# Altium schematic sheet G118_9563_Demo.SchDoc
size A3; PageSetup: Record=PageOptions|CenterHorizontal=True|CenterVertical=True|PrintScale=0.71|XCorrection=1.00|YCorrection=1.00|PrintKind=1|BorderSize=5000000|LeftOffset=0|BottomOffset=0|Orientation=2|PaperLength=2970|PaperWidth=2100|Scale=100|PaperSource=7|PrintQuality=-3|MediaType=1|DitherType=10|PrintScaleMode=1|PaperKind=A4 (210 x 297 毫米)|PaperIndex=9
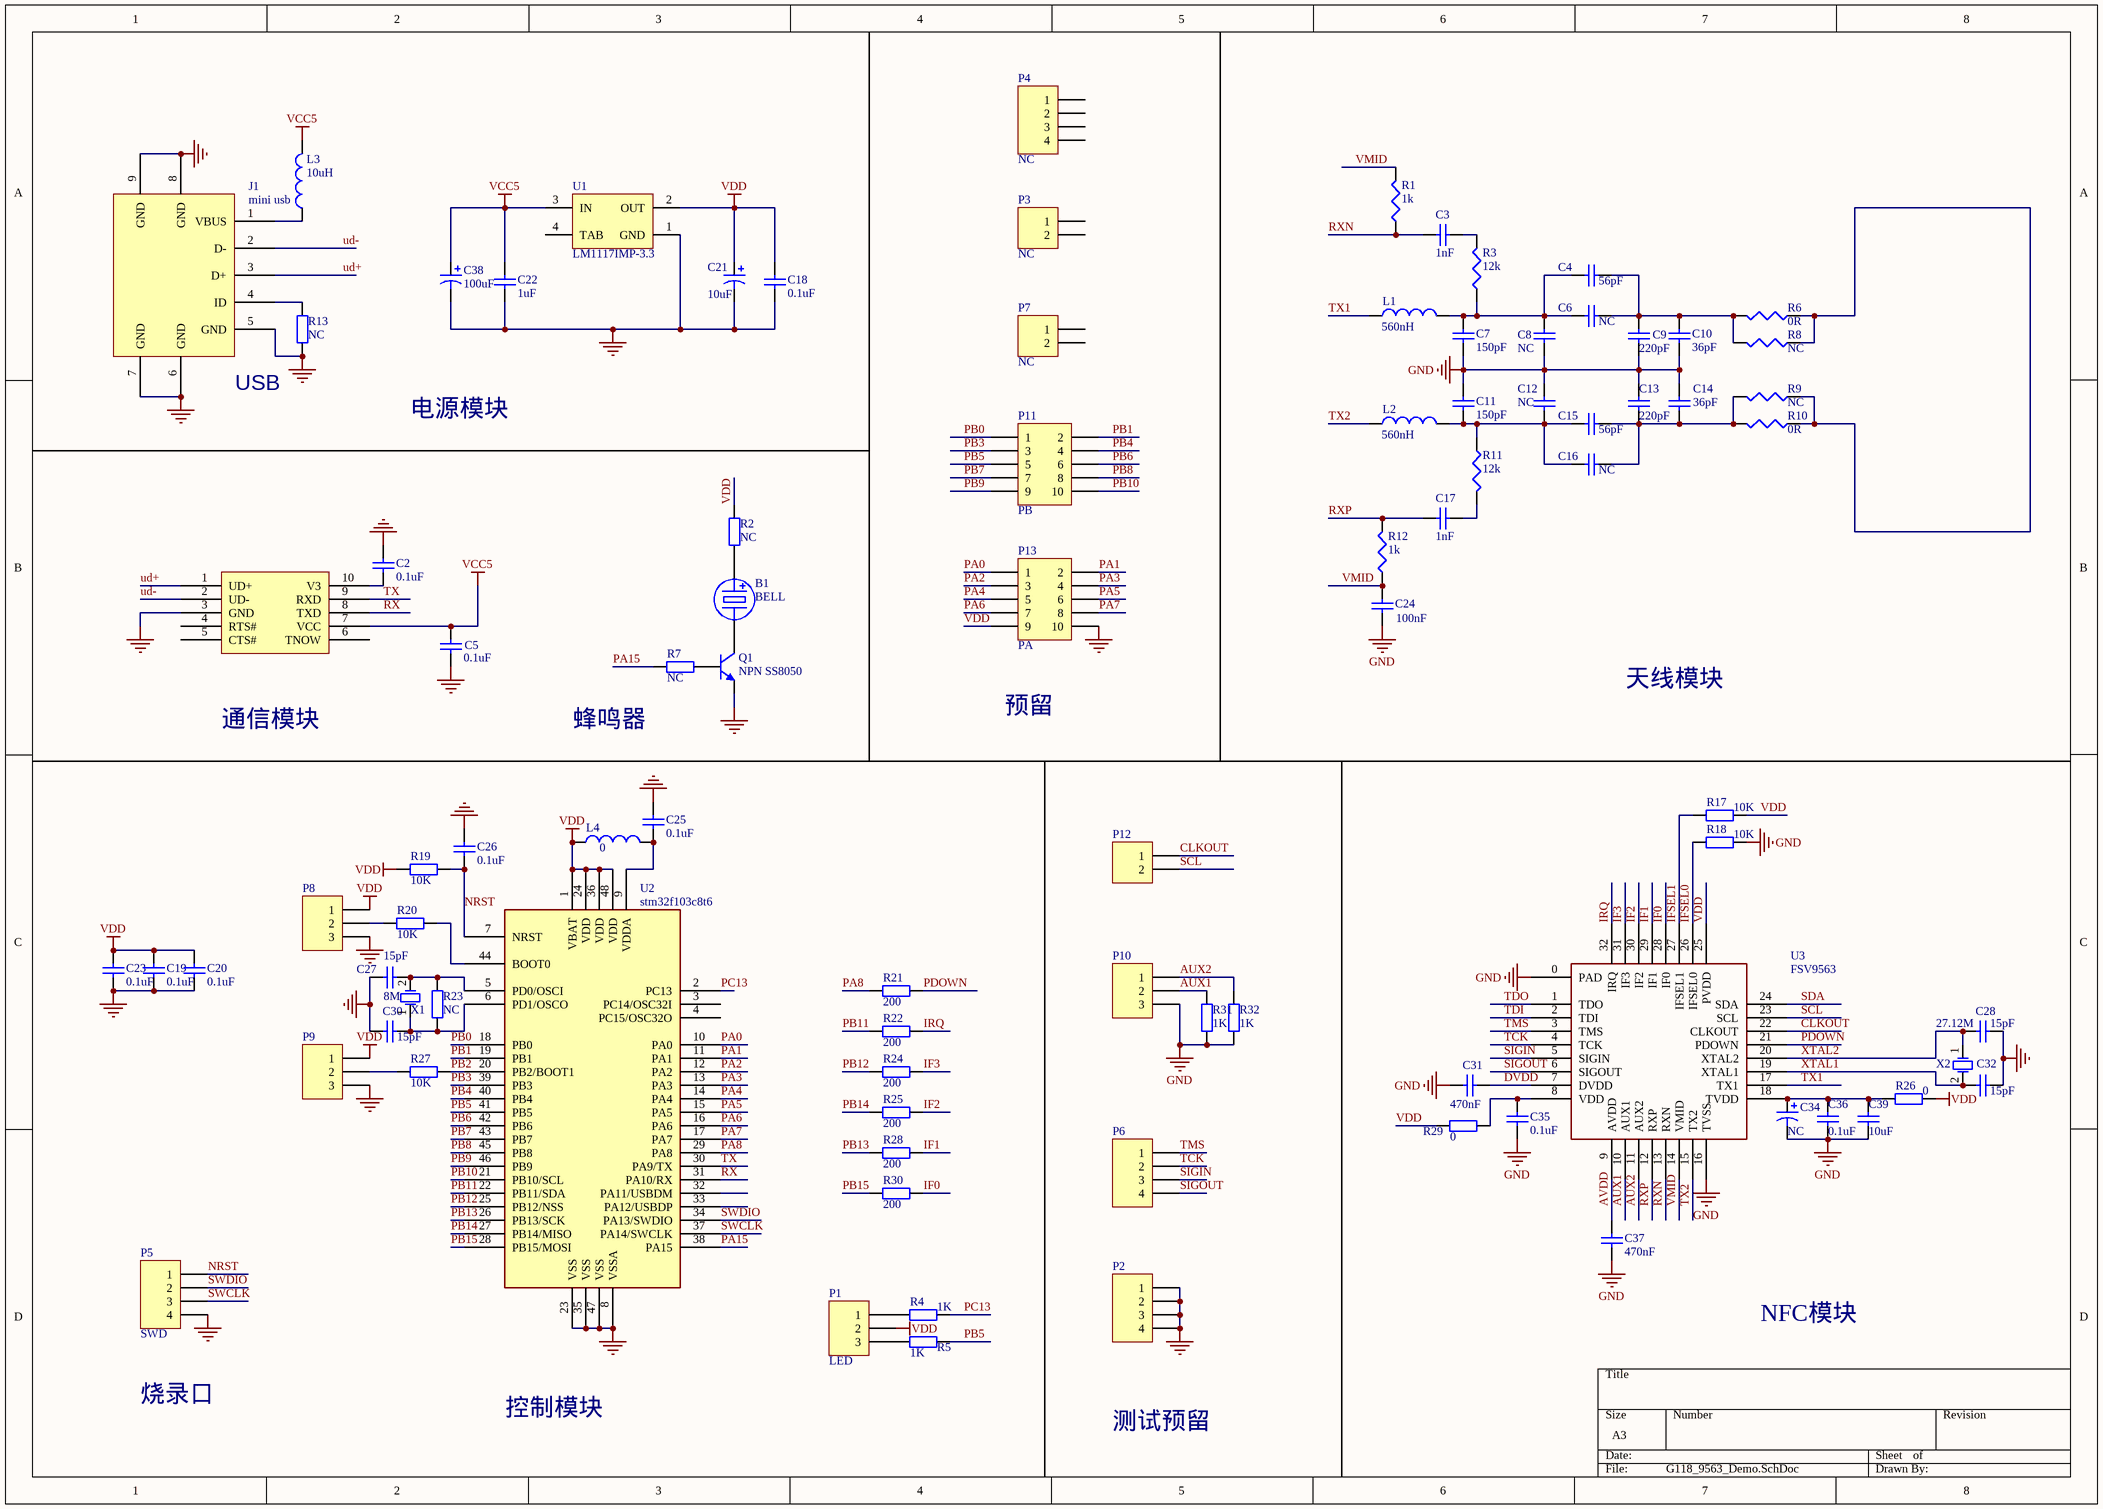
[diagram p0: G118_9563_Demo.SchDoc]

## Parts
B1  BELL  [BELL_S]
C2  0.1uF  [0704C]
C3  value 1nF  [0704C]  (hidden comment: Cap Semi)
C4  value 56pF  [0704C]  (hidden comment: Cap Semi)
C5  0.1uF  [0704C]
C6  value NC  [0704C]  (hidden comment: Cap Semi)
C7  value 150pF  [0704C]  (hidden comment: Cap Semi)
C8  value NC  [0704C]  (hidden comment: Cap Semi)
C9  value 220pF  [0704C]  (hidden comment: Cap Semi)
C10  value 36pF  [0704C]  (hidden comment: Cap Semi)
C11  value 150pF  [0704C]  (hidden comment: Cap Semi)
C12  value NC  [0704C]  (hidden comment: Cap Semi)
C13  value 220pF  [0704C]  (hidden comment: Cap Semi)
C14  value 36pF  [0704C]  (hidden comment: Cap Semi)
C15  value 56pF  [0704C]  (hidden comment: Cap Semi)
C16  value NC  [0704C]  (hidden comment: Cap Semi)
C17  value 1nF  [0704C]  (hidden comment: Cap Semi)
C18  0.1uF  [0704C]
C19  0.1uF  [0704C]
C20  0.1uF  [0704C]
C21  10uF  [RB.1/.2]
C22  1uF  [0704C]
C23  0.1uF  [0704C]
C24  value 100nF  [0704C]
C25  0.1uF  [0704C]
C26  0.1uF  [0704C]
C27  15pF  [0704C]
C28  15pF  [0704C]
C30  15pF  [0704C]
C31  value 470nF  [0704C]  (hidden comment: Cap Semi)
C32  15pF  [0704C]
C34  NC  [RB.1/.2]
C35  0.1uF  [0704C]
C36  0.1uF  [0704C]
C37  value 470nF  [0704C]  (hidden comment: Cap Semi)
C38  100uF  [RB.1/.2]
C39  10uF  [0704C]
CH1  CH340E  [msop-10]  (value not drawn)
J1  mini usb  [usb_mini]
L1  value 560nH  [1210L]  (hidden comment: Inductor)
L2  value 560nH  [1210L]  (hidden comment: Inductor)
L3  10uH  [1206]
L4  0  [1206]
P1  LED  [HDR1X3]
P2  (no value)  [HDR1X4]
P3  NC  [HDR1X2]
P4  NC  [HDR1X4]
P5  SWD  [HDR1X4]
P6  (no value)  [HDR1X4]
P7  NC  [HDR1X2]
P8  (no value)  [HDR1X3]
P9  (no value)  [HDR1X3]
P10  (no value)  [HDR1X3]
P11  PB  [HDR2X5]
P12  (no value)  [HDR1X2]
P13  PA  [HDR2X5]
Q1  NPN SS8050  [SOT-23-2]
R1  value 1k  [0704]  (hidden comment: Res3)
R2  NC  [0704]
R3  value 12k  [0704]  (hidden comment: Res3)
R4  1K  [0704]
R5  1K  [0704]
R6  value 0R  [0704]  (hidden comment: Res3)
R7  NC  [0704]
R8  value NC  [0704]  (hidden comment: Res3)
R9  value NC  [0704]  (hidden comment: Res3)
R10  value 0R  [0704]  (hidden comment: Res3)
R11  value 12k  [0704]  (hidden comment: Res3)
R12  value 1k  [0704]  (hidden comment: Res3)
R13  NC  [0704]
R17  10K  [0704]
R18  10K  [0704]
R19  10K  [0704]
R20  10K  [0704]
R21  200  [0704]
R22  200  [0704]
R23  NC  [0704]
R24  200  [0704]
R25  200  [0704]
R26  0  [0704]
R27  10K  [0704]
R28  200  [0704]
R29  0  [0704]
R30  200  [0704]
R31  1K  [0704]
R32  1K  [0704]
U1  LM1117IMP-3.3  [MP04A_N]
U2  stm32f103c8t6  [LQFP48L]
U3  FSV9563  [QFN-32]
X1  8M  [CRYSTAL]
X2  27.12M  [CRYSTAL]

## Nets
GND: C2.2 C5.2 C7.2 C8.2 C9.2 C10.2 C11.1 C12.1 C13.1 C14.1 C18.2 C19.2 C20.2 C21.2 C22.2 C23.2 C24.2 C25.1 C26.1 C27.1 C28.1 C30.1 C31.1 C32.1 C34.2 C35.2 C36.2 C37.1 C38.2 C39.2 CH1.3(GND) J1.5(GND) J1.6(GND) J1.7(GND) J1.8(GND) J1.9(GND) P2.1 P2.2 P2.3 P2.4 P5.4 P8.3 P9.3 P10.3 P13.10 Q1.3 R13.2 R18.2 R31.1 R32.1 U1.1(GND) U2.8(VSSA) U2.23(VSS) U2.35(VSS) U2.47(VSS) U3.0(PAD) U3.16(TVSS)
VCC5: C5.1 C22.1 C38.1 CH1.7(VCC) L3.2 U1.3(IN)
VDD: C18.1 C19.1 C20.1 C21.1 C23.1 L4.1 P1.2 P8.1 P9.1 P13.9 R2.1 R17.2 R19.1 R26.2 R29.1 U1.2(OUT) U2.1(VBAT) U2.24(VDD) U2.36(VDD) U2.48(VDD) U3.25(PVDD)
AUX1: P10.2 R31.2 U3.10(AUX1)
AUX2: P10.1 R32.2 U3.11(AUX2)
AVDD: C37.2 U3.9(AVDD)
CLKOUT: P12.1 U3.22(CLKOUT)
DVDD: C31.2 U3.7(DVDD)
IF0: R30.2 U3.28(IF0)
IF1: R28.2 U3.29(IF1)
IF2: R25.2 U3.30(IF2)
IF3: R24.2 U3.31(IF3)
IFSEL0: R18.1 U3.26(IFSEL0)
IFSEL1: R17.1 U3.27(IFSEL1)
IRQ: R22.2 U3.32(IRQ)
NRST: C26.2 P5.1 R19.2 U2.7(NRST)
PA0: P13.1 U2.10(PA0)
PA1: P13.2 U2.11(PA1)
PA2: P13.3 U2.12(PA2)
PA3: P13.4 U2.13(PA3)
PA4: P13.5 U2.14(PA4)
PA5: P13.6 U2.15(PA5)
PA6: P13.7 U2.16(PA6)
PA7: P13.8 U2.17(PA7)
PA8: R21.1 U2.29(PA8)
PA15: R7.1 U2.38(PA15)
PB0: P11.1 U2.18(PB0)
PB1: P11.2 U2.19(PB1)
PB2: R27.2 U2.20(PB2/BOOT1)
PB3: P11.3 U2.39(PB3)
PB4: P11.4 U2.40(PB4)
PB5: P11.5 R5.1 U2.41(PB5)
PB6: P11.6 U2.42(PB6)
PB7: P11.7 U2.43(PB7)
PB8: P11.8 U2.45(PB8)
PB9: P11.9 U2.46(PB9)
PB10: P11.10 U2.21(PB10/SCL)
PB11: R22.1 U2.22(PB11/SDA)
PB12: R24.1 U2.25(PB12/NSS)
PB13: R28.1 U2.26(PB13/SCK)
PB14: R25.1 U2.27(PB14/MISO)
PB15: R30.1 U2.28(PB15/MOSI)
PC13: R4.2 U2.2(PC13)
PDOWN: R21.2 U3.21(PDOWN)
RX: CH1.8(TXD) U2.31(PA10/RX)
RXN: C3.2 R1.1 U3.13(RXN)
RXP: C17.2 R12.1 U3.12(RXP)
SCL: P12.2 U3.23(SCL)
SDA: U3.24(SDA)
SIGIN: P6.3 U3.5(SIGIN)
SIGOUT: P6.4 U3.6(SIGOUT)
SWCLK: P5.3 U2.37(PA14/SWCLK)
SWDIO: P5.2 U2.34(PA13/SWDIO)
TCK: P6.2 U3.4(TCK)
TDI: U3.2(TDI)
TDO: U3.1(TDO)
TMS: P6.1 U3.3(TMS)
TX: CH1.9(RXD) U2.30(PA9/TX)
TX1: L1.1 U3.17(TX1)
TX2: L2.1 U3.15(TX2)
ud+: CH1.1(UD+) J1.3(D+)
ud-: CH1.2(UD-) J1.2(D-)
VMID: C24.1 R1.2 R12.2 U3.14(VMID)
XTAL1: C32.2 U3.19(XTAL1) X2.2(OSC2)
XTAL2: C28.2 U3.20(XTAL2) X2.1(OSC1)
NetB1_1: B1.1(+) R2.2
NetB1_2: B1.2(-) Q1.1
NetC2_1: C2.1 CH1.10(V3)
NetC3_1: C3.1 R3.2
NetC4_1: C4.1 C6.2 C7.1 C8.1 L1.2 R3.1
NetC4_2: C4.2 C6.1 C9.1 C10.1 R6.2 R8.2
NetC11_2: C11.2 C12.2 C15.2 C16.1 L2.2 R11.2
NetC13_2: C13.2 C14.2 C15.1 C16.2 R9.2 R10.2
NetC17_1: C17.1 R11.1
NetC25_2: C25.2 L4.2 U2.9(VDDA)
NetC27_2: C27.2 R23.2 U2.5(PD0/OSCI) X1.2(OSC2)
NetC30_2: C30.2 R23.1 U2.6(PD1/OSCO) X1.1(OSC1)
NetC34_1: C34.1 C36.1 C39.1 R26.1 U3.18(TVDD)
NetC35_1: C35.1 R29.2 U3.8(VDD)
NetJ1_1: J1.1(VBUS) L3.1
NetJ1_4: J1.4(ID) R13.1
NetP1_1: P1.1 R4.1
NetP1_3: P1.3 R5.2
NetP8_2: P8.2 R20.1
NetP9_2: P9.2 R27.1
NetQ1_2: Q1.2 R7.2
NetR6_1: R6.1 R8.1 R9.1 R10.1
NetR20_2: R20.2 U2.44(BOOT0)

Not connected (* = marked no-connect by the designer): CH1 4(RTS#) 5(CTS#) 6(TNOW); P3 1 2; P4 1 2 3 4; P7 1 2; U1 4(TAB); U2 3(PC14/OSC32I) 4(PC15/OSC32O) 32(PA11/USBDM) 33(PA12/USBDP)

## Notes on the sheet
- (near J1) USB
- 电源模块
- 预留
- 天线模块
- 通信模块
- 蜂鸣器
- NFC模块
- 烧录口
- 控制模块
- 测试预留

## Library data of the parts
C2 C5 C18-C20 C22 C23 C25-C28 C30 C32 C35 C36 C39 = Capacitor
C3 C4 C6-C17 C24 C31 C37 = Cap Semi: Capacitor (Semiconductor SIM Model); Published: 8-Jun-2000; LatestRevisionDate: 29-May-2009; LatestRevisionNote: IPC-7351 Footprint Added.; PackageReference: C1206; Publisher: Altium Limited; PackageDescription: Chip Capacitor
C21 C34 C38 = CapPolar
J1 = MINI_USB
L1 L2 = Inductor: Code_IEC: 1005; Published: 8-Jun-2000; LatestRevisionDate: 29-May-2009; LatestRevisionNote: IPC-7351 Footprint Added.; PackageReference: 0402-A; Publisher: Altium Limited; PackageDescription: Chip Inductor; Code_JEITA: 0402
L3 L4 = Inductor
P1 P8-P10 = Header 3: Header, 3-Pin; LatestRevisionDate: 17-Jul-2002; LatestRevisionNote: Re-released for DXP Platform.; Publisher: Altium Limited
P2 P4-P6 = Header 4: Header, 4-Pin; LatestRevisionDate: 17-Jul-2002; LatestRevisionNote: Re-released for DXP Platform.; Publisher: Altium Limited
P3 P7 P12 = Header 2: Header, 2-Pin; LatestRevisionDate: 17-Jul-2002; LatestRevisionNote: Re-released for DXP Platform.; Publisher: Altium Limited
P11 P13 = Header 5X2: Header, 5-Pin, Dual row; LatestRevisionDate: 17-Jul-2002; LatestRevisionNote: Re-released for DXP Platform.; Publisher: Altium Limited
R1 R3 R6 R8-R12 = Res3: Resistor; Published: 8-Jun-2000; LatestRevisionDate: 29-May-2009; LatestRevisionNote: IPC-7351 Footprint Added.; Publisher: Altium Limited; PackageDescription: Chip Resistor
  R1 R6 R8-R12: PackageReference: J1-0603
  R3: PackageReference: 0704
R2 R4 R5 R7 R13 R17-R32 = RES
U1 = LM1117IMP-3.3: 800mA Low-Dropout Linear Regulator; Manufacturer: National Semiconductor; CompType: LDO IC; PackageTopMarking: XYTT*N05B; Published: 4-Dec-2008; DatasheetVersion: Apr-2006; PackageVersion: revB, Apr-2003; PackageReference: MP04A; Publisher: Altium Limited; PackageDescription: Molded SOT-223, 6.50 x 3.56 x 1.6mm Body, 4 Lead, 2.3mm Pitch; PartNumber: LM1117IMP-3.3; RoHS: O; PinCount: 4; DigiKeyPartNumber: LM1117IMP-3.3CT-ND; Code_JEDEC: TO-261-AA; Code_IPC: SOT223-4; ComponentLink1Description: LM1117 Datasheet; ComponentLink1URL: http://www.national.com/ds/LM/LM1117.pdf; ComponentLink2Description: LM1117 Web Page; ComponentLink2URL: http://www.national.com/pf/LM/LM1117.html; ComponentLink3Description: MP04A Package Page; ComponentLink3URL: http://www.national.com/packaging/folders/mp04a.html
U3 = CLRC663: NFC DRIVER
X1 X2 = Crystal